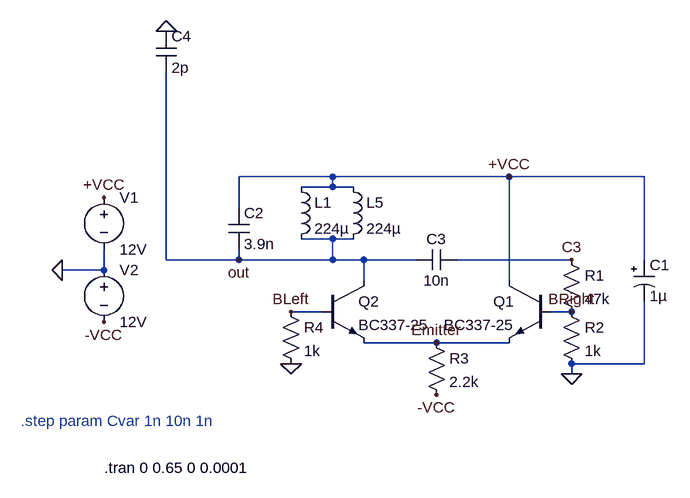
[diagram p0: schematic EM_Theremin_PitchOscilator.asc]
EM_Theremin_PitchOscilator.asc, the LTspice schematic file:
Version 4
SHEET 1 880 680
WIRE 48 -48 -96 -48
WIRE 320 -48 48 -48
WIRE 528 -48 320 -48
WIRE 48 -32 48 -48
WIRE 48 -32 0 -32
WIRE 80 -32 48 -32
WIRE -96 0 -96 -48
WIRE 48 48 0 48
WIRE 80 48 48 48
WIRE -208 80 -208 -208
WIRE -96 80 -96 64
WIRE -96 80 -208 80
WIRE 48 80 48 48
WIRE 48 80 -96 80
WIRE 96 80 48 80
WIRE 176 80 96 80
WIRE 416 80 240 80
WIRE 528 80 528 -48
WIRE -304 96 -304 64
WIRE -304 96 -368 96
WIRE 96 112 96 80
WIRE 320 112 320 -48
WIRE 32 160 -16 160
WIRE 416 160 384 160
WIRE 208 208 96 208
WIRE 320 208 208 208
WIRE 528 240 528 144
WIRE 528 240 416 240
WIRE 416 256 416 240
FLAG 416 256 0
FLAG -16 240 0
FLAG 320 -48 +VCC
FLAG -96 80 out
FLAG -368 96 0
FLAG -304 -16 +VCC
FLAG -304 176 -VCC
FLAG -208 -272 0
FLAG 416 80 C3
FLAG 416 160 BRight
FLAG -16 160 BLeft
FLAG 208 208 Emitter
FLAG 208 288 -VCC
SYMBOL npn 384 112 M0
SYMATTR InstName Q1
SYMATTR Value BC337-25
SYMBOL npn 32 112 R0
SYMATTR InstName Q2
SYMATTR Value BC337-25
SYMBOL res 400 64 R0
SYMATTR InstName R1
SYMATTR Value 47k
SYMBOL res 400 144 R0
SYMATTR InstName R2
SYMATTR Value 1k
SYMBOL cap -112 0 R0
SYMATTR InstName C2
SYMATTR Value 3.9n
SYMBOL res -32 144 R0
SYMATTR InstName R4
SYMATTR Value 1k
SYMBOL voltage -304 -32 R0
SYMATTR InstName V1
SYMATTR Value 12V
SYMBOL voltage -304 80 R0
SYMATTR InstName V2
SYMATTR Value 12V
SYMBOL cap -224 -272 R0
SYMATTR InstName C4
SYMATTR Value 2p
SYMBOL ind -16 -48 R0
SYMATTR InstName L1
SYMATTR Value 224µ
SYMBOL ind 64 -48 R0
SYMATTR InstName L5
SYMATTR Value 224µ
SYMBOL polcap 512 80 R0
SYMATTR InstName C1
SYMATTR Value 1µ
SYMBOL cap 240 64 R90
WINDOW 0 0 32 VBottom 2
WINDOW 3 32 32 VTop 2
SYMATTR InstName C3
SYMATTR Value 10n
SYMBOL res 192 192 R0
SYMATTR InstName R3
SYMATTR Value 2.2k
TEXT -304 400 Left 2 !.tran 0 0.65 0 0.0001
TEXT -432 328 Left 2 ;.step param Cvar 1n 10n 1n

The netlist it stands for:
* EM_Theremin_PitchOscilator.asc
Q1 +VCC BRight Emitter 0 BC337-25
Q2 out BLeft Emitter 0 BC337-25
R1 C3 BRight 47k
R2 BRight 0 1k
C2 +VCC out 3.9n
R4 BLeft 0 1k
V1 +VCC 0 12V
V2 0 -VCC 12V
C4 0 out 2p
L1 +VCC out 224µ
L5 +VCC out 224µ
C1 +VCC 0 1µ
C3 C3 out 10n
R3 Emitter -VCC 2.2k
.model NPN NPN
.model PNP PNP
.lib standard.bjt
.tran 0 0.65 0 0.0001
* .step param Cvar 1n 10n 1n
.backanno
.end